# EAGLE design roten (EAGLE 6.5.0)
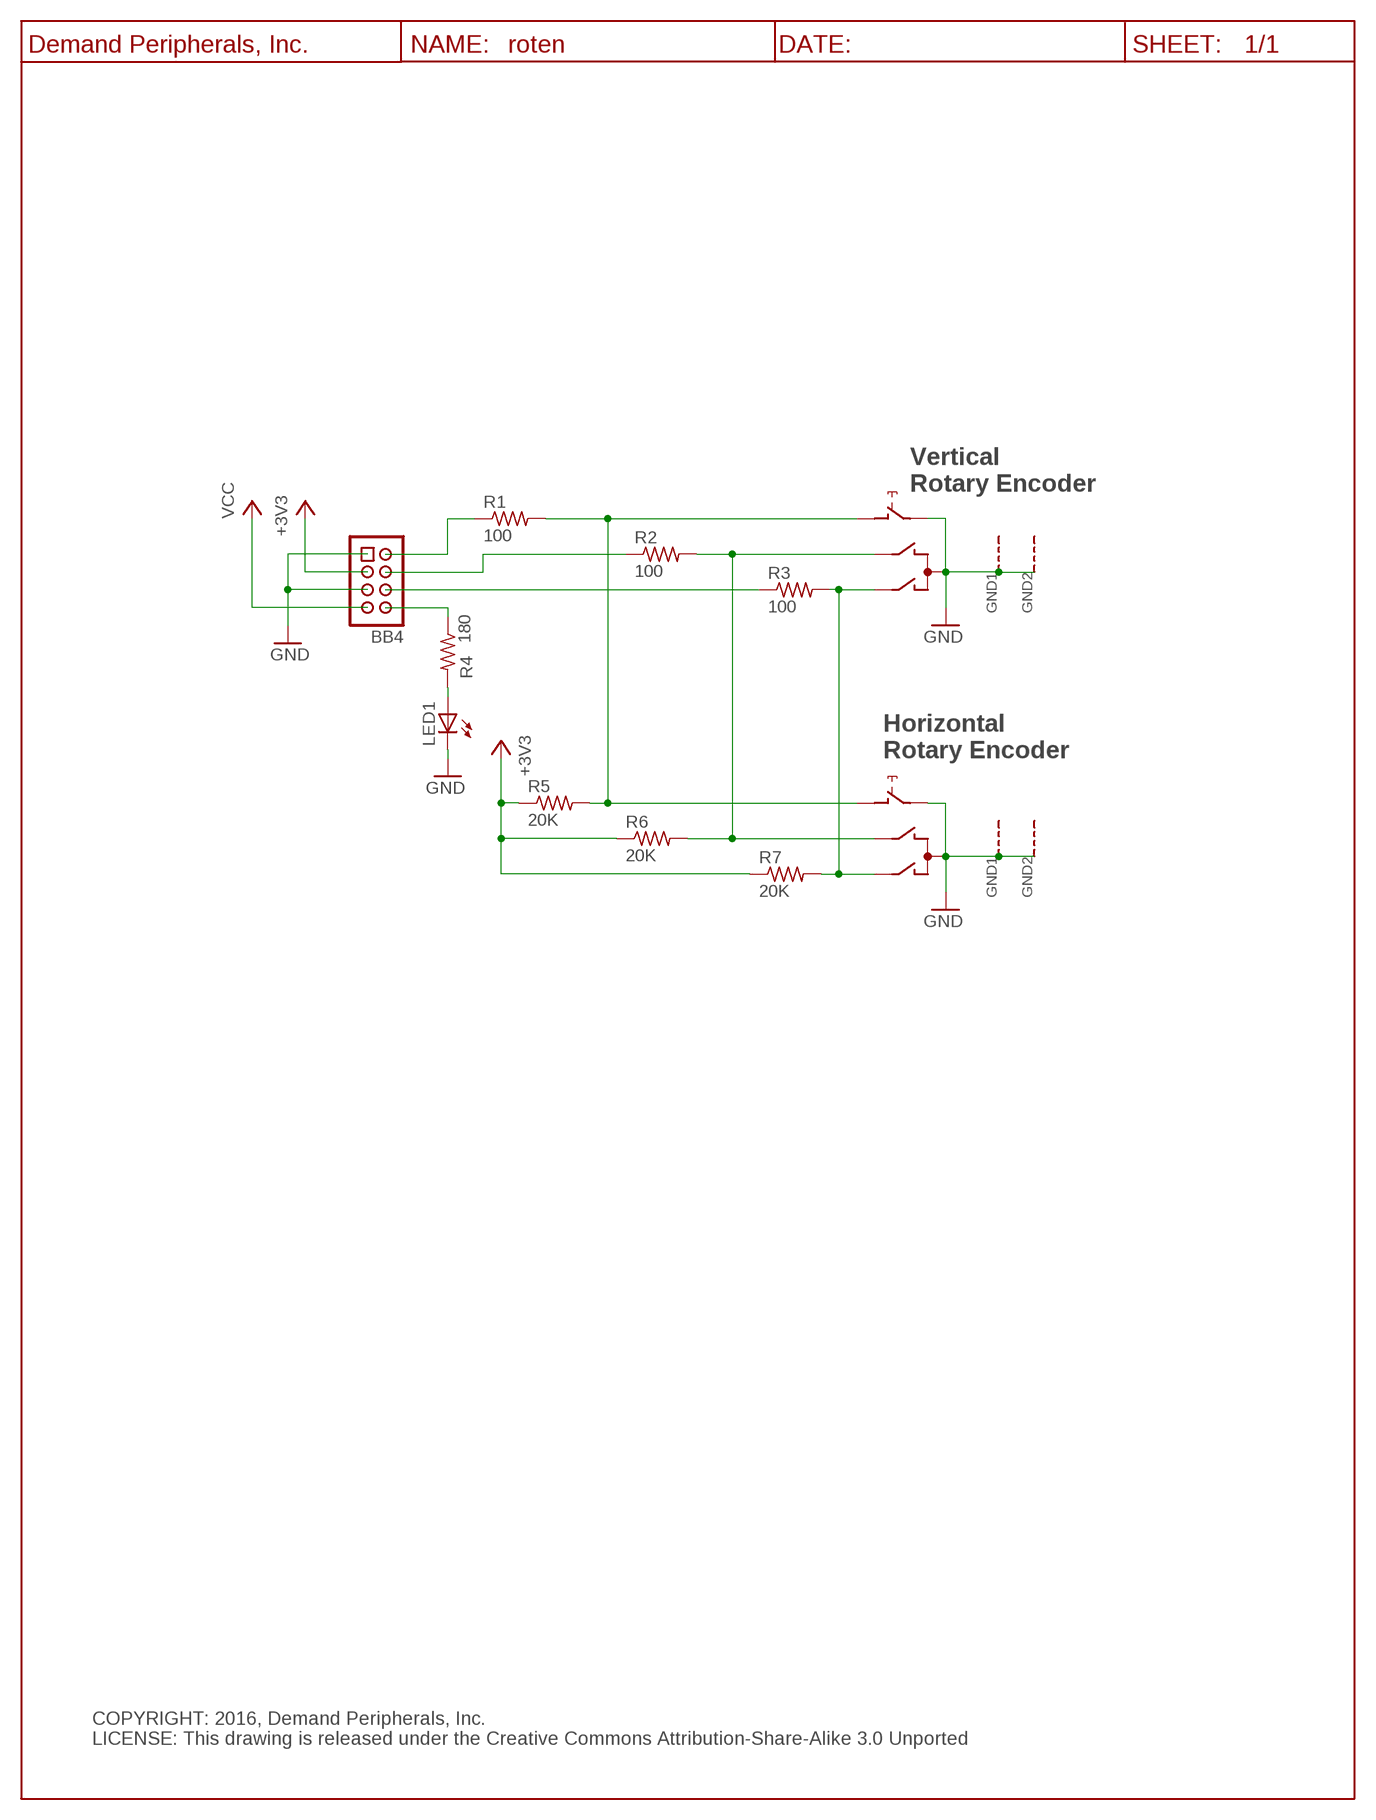
[diagram p0: schematic, sheet 1]

## Parts
1  ROTARY_ENCODER_W_SWITCHCTS_V_120  ROTARY_ENCODER_W_SWITCHCTS_V_290  [CTS_290_VERT]
2  ROTARY_ENCODER_W_SWITCH  [BI_EN11_HORIZ]
BB4  HDR-4X2-SHR  [HDR-4X2]
LED1  LED-5MM-GRN  [LED5MM]
R1  100  R100_R0603  [R0603]
R2  100  R100_R0603  [R0603]
R3  100  R100_R0603  [R0603]
R4  180  R220_R0603  [R0603]
R5  20K  R20K_R0603  [R0603]
R6  20K  R20K_R0603  [R0603]
R7  20K  R20K_R0603  [R0603]
U$1  DP_FRAME_P  [P_FRAME]

## Nets
+3V3: BB4.3 R5.1 R6.1 R7.1
GND: 1.C 1.E 1.GND1(G) 1.GND2(G) 2.C 2.E 2.GND1(G) 2.GND2(G) BB4.1 BB4.5 LED1.C
N$3: 1.D 2.D R1.2 R5.2
N$5: BB4.2 R1.1
N$6: BB4.4 R2.1
N$7: BB4.6 R3.1
N$8: BB4.8 R4.1
N$9: LED1.A R4.2
N$12: 1.A 2.A R3.2 R7.2
N$14: 1.B 2.B R2.2 R6.2
VCC: BB4.7

## Notes on the sheet
- Vertical
- Rotary Encoder
- Horizontal
- Rotary Encoder
- COPYRIGHT: 2016, Demand Peripherals, Inc.
  LICENSE: This drawing is released under the Creative Commons Attribution-Share-Alike 3.0 Unported

## Library data of the parts
1 = dpi-swsens:ROTARY_ENCODER_W_SWITCH; VENDOR: Digikey; VENDOR-PART-NUM: CT3006-ND
2 = dpi-swsens:ROTARY_ENCODER_W_SWITCH; VENDOR: Digikey; VENDOR-PART-NUM: PEC11-4020F-S0024-ND
BB4 = dpi-conn:HDR-4X2-SHR: Shrouded 4x2 pin header; VENDOR: Digikey; VENDOR-PART-NUM: 609-3530-ND
LED1 = dpi-diopto:LED-5MM-GRN: Green LED, 5 MM, through-hole; VENDOR: Digikey; VENDOR-PART-NUM: 160-1852-ND
R1-R3 = dpi-passive:R100_: 100 Ohm resistor, 1%, 0.1 watt; VENDOR: Digikey; VENDOR-PART-NUM: 311-100HRTR-ND
R4 = dpi-passive:R220_: 330 Ohm resistor, 1%, 0.1 watt; VENDOR: Digikey; VENDOR-PART-NUM: 311-220HRTR-ND
R5-R7 = dpi-passive:R20K_: 20K Resistor, 1%, 0.1 watt; VENDOR: Digikey; VENDOR-PART-NUM: 311-20.0KHRTR-ND
U$1 = dpi-sym:DP_FRAME_P: Portrait/Letter Document Frame

## Board
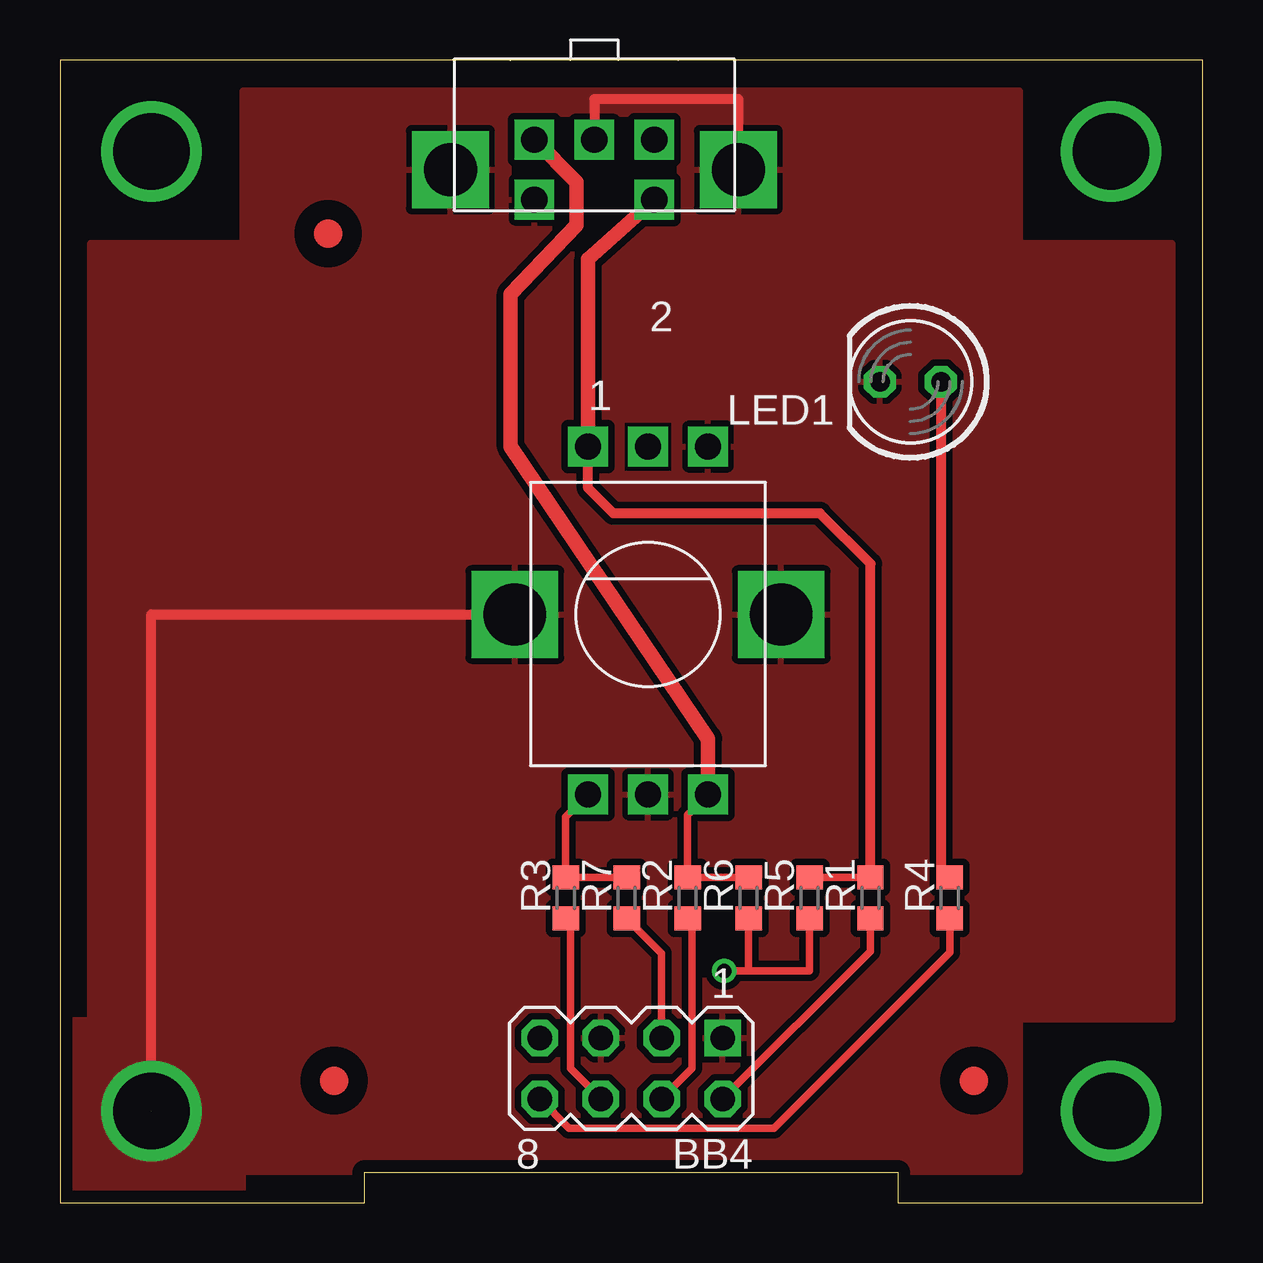
[diagram p1: board, top side]
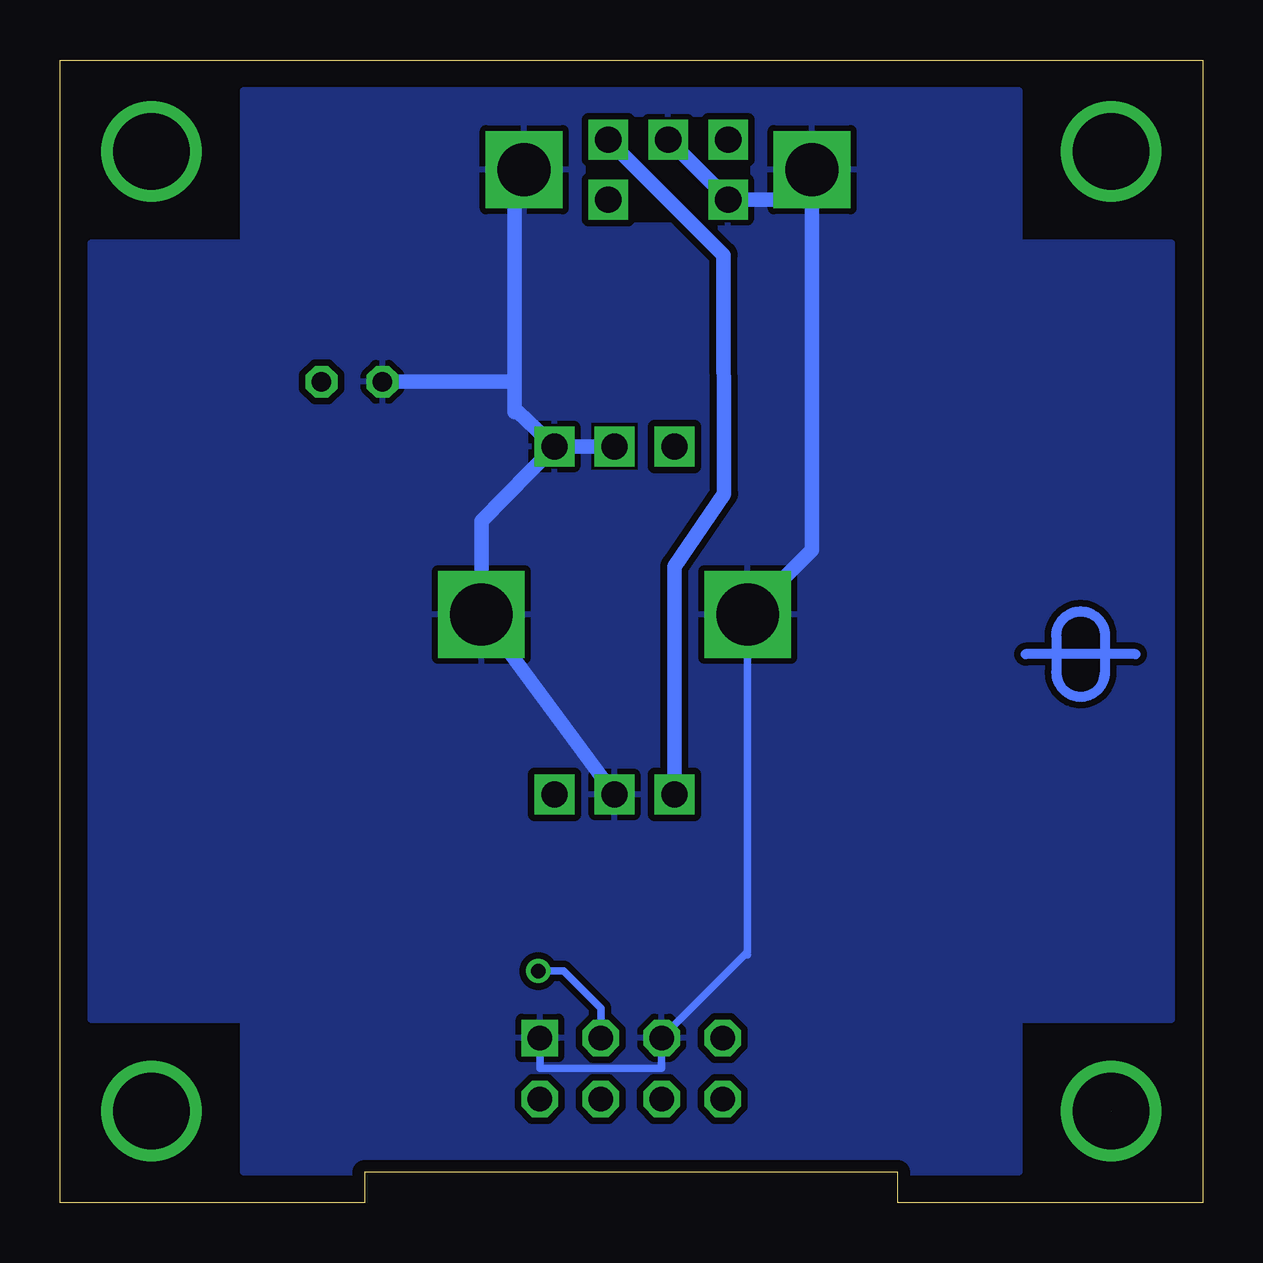
[diagram p2: board, bottom side, seen from below]

Size 47.62 x 47.62 mm. Coordinates in mm from the lower left corner, seen from the top.
Outline: 0,0 12.7,0 12.7,1.27 34.92,1.27 34.92,0 47.62,0 47.62,47.62 0,47.62 0,0
Copper layers (1*16): Top 0.035mm / dielectric 1.5mm / Bottom 0.035mm
Design rules "default *": minimum track width 10mil, minimum drill 20mil, track to track 11mil, track to pad 11mil, pad to pad 8mil, via to via 8mil, smd to smd 8mil, copper to edge 20mil, drill to drill 8mil, minimum pad ring 10mil, minimum via ring 8mil, stop-mask expansion 4mil, vias tented up to drill 0mil, thermal gap 10mil
tKeepout: area 15.2,1.2 to 32.5,10.4
tRestrict: area 23.6,30.5 to 25.5,32.5; area 26.1,30.6 to 27.9,32.4; area 18.8,40.9 to 25.7,45.2
bRestrict: area 23.6,30.6 to 25.5,32.5; area 26.1,30.6 to 27.9,32.4; area 18.9,40.9 to 25.7,45.2

### Footprints (pad centres in the part's own frame; a part is rotated, then mirrored left to right if it is on the bottom)
CTS_290_VERT = drill 1.1 square: A -2.5,-7.5; B 2.5,-7.5; C 0,-7.5; D -2.5,7; E 2.5,7 | drill 2.6 square: GND1 -5.55,0; GND2 5.55,0
BI_EN11_HORIZ = drill 1.1 square: A -2.5,-1.25; B 2.5,-1.25; C 0,-1.25; D -2.5,1.25; E 2.5,1.25 | drill 2.2 square: GND1 -6,0; GND2 6,0
HDR-4X2 = drill 1.016 square: 1 -3.81,-1.27 | drill 1.016 octagon: 2 -3.81,1.27; 3 -1.27,-1.27; 4 -1.27,1.27; 5 1.27,-1.27; 6 1.27,1.27; 7 3.81,-1.27; 8 3.81,1.27
LED5MM = drill 0.813 octagon: A -1.27,0; C 1.27,0
R0603 = smd 1 x 1.1: 1 -0.85,0; 2 0.85,0

### Placement (x,y rotation side)
1  24.51,24.51 0 top
2  22.28,43.05 180 top
BB4  23.81,5.59 180 top
LED1  35.45,34.21 180 top
R1  33.78,12.7 90 top
R2  26.16,12.7 90 top
R3  21.08,12.7 90 top
R4  37.08,12.7 90 top
R5  31.24,12.7 90 top
R6  28.7,12.7 90 top
R7  23.62,12.7 90 top
U$1  -2.54,-2.54 0 top
U$4  [FIDUCIAL]  11.43,5.08 0 top
U$5  [FIDUCIAL]  38.1,5.08 0 top
U$6  [FIDUCIAL]  11.18,40.39 0 top
U$7  [DPI-1]  5.08,22.86 270 bottom

### Tracks (layer width: path | path; a pad name or v marks a point on that pad's centre or on a via)
+3V3  (via drill 0.6)
  Top 0.305: BB4.3 25.08,10.39 R7.1 | R5.1 31.24,9.65 29.05,9.65 | 29.05,9.65 v27.69,9.65 | R6.1 28.7,9.65 29.05,9.65
  Bottom 0.305: BB4.3 25.08,8.1 26.63,9.65 v27.69,9.65
GND  (via drill 1.1, 3.17)  (1 unrouted)
  Top 0.406: 1.GND1 3.81,24.51 v3.81,3.81 | 2.GND1 28.28,46 22.84,46 22.28,46 2.C
  Bottom 0.305: BB4.1 27.62,5.59 23.81,5.59 22.54,5.59 BB4.5 18.96,10.44 1.GND1 | 19.07,10.32 18.96,10.32
  Bottom 0.61: 1.C 1.GND2 30.05,28.4 1.E | 2.C 19.79,41.83 2.E 16.84,41.8 2.GND2 16.28,27.2 1.GND1 | 1.E v24.51,31.51 | 1.E 28.52,32.94 28.68,32.94 28.68,34.28 | 28.68,34.28 28.68,42.7 2.GND1 | LED1.C 28.68,34.21 28.68,34.28
  pour Top: 1.27,40.01 7.62,40.01 7.62,46.35 40.01,46.35 40.01,40.01 46.35,40.01 46.35,7.62 40.01,7.62 40.01,1.27 7.62,1.27 7.62,0.51 0.51,0.51 0.51,7.62 1.27,7.62
  pour Bottom: 1.27,40.01 7.62,40.01 7.62,46.35 40.01,46.35 40.01,40.01 46.35,40.01 46.35,7.62 40.01,7.62 40.01,1.27 7.62,1.27 7.62,7.62 1.27,7.62
MOUNT2  (via drill 3.17)
  other vias: 43.81,43.81
MOUNT3  (via drill 3.17)
  other vias: 43.81,3.81
MOUNT4  (via drill 3.17)
  other vias: 3.81,43.81
N$3
  Top 0.305: R5.2 R1.2
  Top 0.406: R1.2 33.78,26.63 31.69,28.73 23.06,28.73 22.09,29.7 22.01,29.78 1.D
  Top 0.61: 1.D 22.01,39.32 2.D
N$5
  Top 0.305: BB4.2 33.78,10.48 R1.1
N$6
  Top 0.305: BB4.4 26.35,5.59 26.35,7.07 26.35,11.66 R2.1
N$7
  Top 0.305: BB4.6 21.27,5.59 21.27,7.09 21.27,11.66 R3.1
N$8
  Top 0.305: BB4.8 21.22,3.1 29.76,3.1 37.08,10.43 R4.1
N$9
  Top 0.406: LED1.A 36.72,13.55 R4.2
N$12
  Top 0.305: R7.2 R3.2 21.08,16.08 1.A
  Bottom 0.61: 1.A 22.01,26.52 19.94,29.54 19.96,39.5 2.A
N$14
  Top 0.305: 1.B 26.16,16.16 R2.2 R6.2
  Top 0.61: 1.B 27.01,19.33 18.79,31.51 18.79,37.87 21.54,40.75 21.54,42.52 2.B

### Text on the board
tTest: 1.875 Inches | 1.575 Inches | SW2 | (C) 2017, Demand Peripherals, Inc. | LED1 | SW1 | ROTEN, Rev 17A | 1.575 Inches | 1.875 Inches | R3 | R7 | R2 | R5 | R6 | R1 | R4 | BB4